# Altium project PCB_Project1.PrjPCB
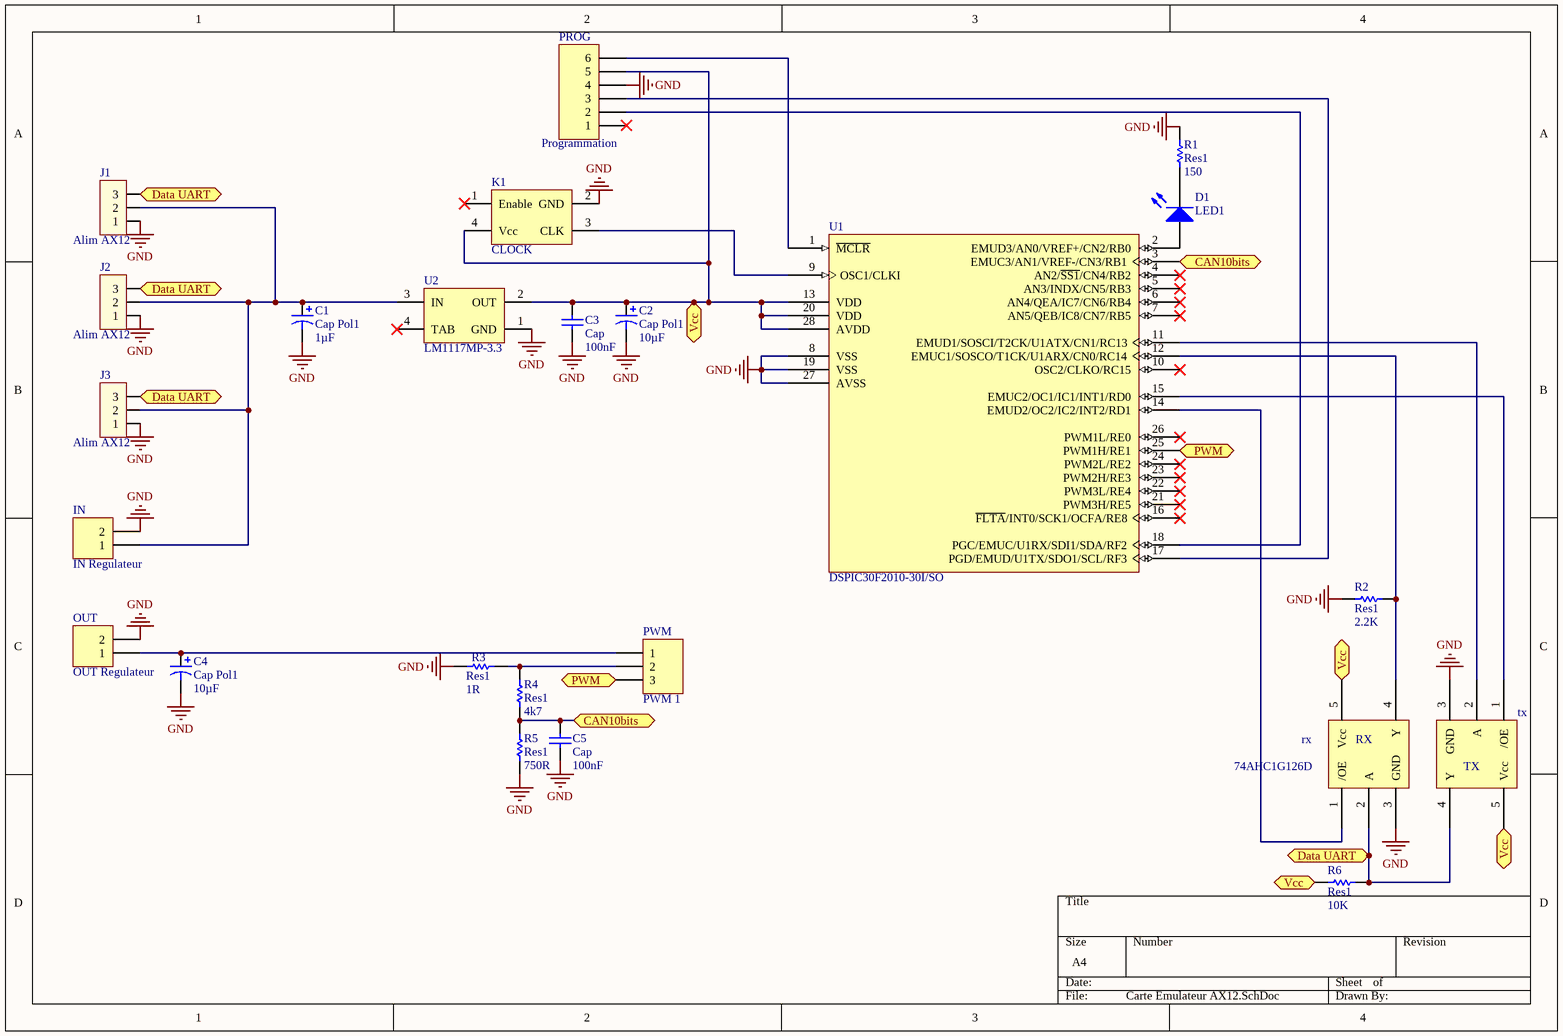
[diagram p0: Carte Emulateur AX12.SchDoc]
1 sheet, 24 parts. Net scope: flat (ports and power ports of the same name join across sheets).
Board files: Carte Emulateur AX12 - Version Double.PcbDoc, Carte Emulateur AX12.PcbDoc

## Sheet Carte Emulateur AX12.SchDoc
size A4

### Parts
C1  Cap Pol1  value 1µF  [C0805]
C2  Cap Pol1  value 10µF  [C0805]
C3  Cap  value 100nF  [0805]
C4  Cap Pol1  value 10µF  [C0805]
C5  Cap  value 100nF  [0805]
D1  LED1  [C0805]
IN  IN Regulateur  [HDR1X2]
J1  Alim AX12  [MOLEX_AX12_3]
J2  Alim AX12  [MOLEX_AX12_3]
J3  Alim AX12  [MOLEX_AX12_3]
K1  CLOCK  [IQXO-70]
OUT  OUT Regulateur  [HDR1X2]
PROG  Programmation  [690367280676]
PWM  PWM 1  [HDR1X3H]
R1  Res1  value 150  [0805]
R2  Res1  value 2.2K  [0805]
R3  Res1  value 1R  [L1W-2512]
R4  Res1  value 4k7  [0805]
R5  Res1  value 750R  [0805]
R6  Res1  value 10K  [0805]
rx  74AHC1G126D  [74AHC1G126DVBR]
tx  74AHC1G126D  [74AHC1G126DVBR]  (value not drawn)
U1  DSPIC30F2010-30I/SO  [SOIC-SO28_M]
U2  LM1117MP-3.3  [MP04A_N]

### Ports
CAN10bits, Data UART (bidir), PWM (bidir), Vcc

### Nets
GND: C1.2 C2.2 C3.1 C4.2 C5.1 IN.2 J1.1 J2.1 J3.1 K1.2(GND) OUT.2 PROG.4 R1.2 R2.2 R3.2 R5.1 rx.3(GND) tx.3(GND) U1.8(VSS) U1.19(VSS) U1.27(AVSS) U2.1(GND)
NetC1_1: C1.1 IN.1 J1.2 J2.2 J3.2 U2.3(IN)
NetC2_1: C2.1 C3.2 K1.4(Vcc) PROG.5 R6.2 rx.5(Vcc) tx.5(Vcc) U1.13(VDD) U1.20(VDD) U1.28(AVDD) U2.2(OUT) ; port Vcc
NetC4_1: C4.1 OUT.1 PWM.1
NetC5_2: C5.2 R4.1 R5.2 U1.3(EMUC3/AN1/VREF-/CN3/RB1) ; port CAN10bits
NetD1_1: D1.1(A) U1.2(EMUD3/AN0/VREF+/CN2/RB0)
NetD1_2: D1.2(K) R1.1
NetJ1_3: J1.3 J2.3 J3.3 R6.1 rx.2(A) tx.4(Y) ; port Data UART
NetK1_3: K1.3(CLK) U1.9(OSC1/CLKI)
NetPROG_2: PROG.2 U1.18(PGC/EMUC/U1RX/SDI1/SDA/RF2)
NetPROG_3: PROG.3 U1.17(PGD/EMUD/U1TX/SDO1/SCL/RF3)
NetPROG_6: PROG.6 U1.1(~{MCLR})
NetPWM_2: PWM.2 R3.1 R4.2
NetPWM_3: PWM.3 U1.25(PWM1H/RE1) ; port PWM
NetR2_1: R2.1 rx.4(Y) U1.12(EMUC1/SOSCO/T1CK/U1ARX/CN0/RC14)
Netrx_1: rx.1(/OE) U1.14(EMUD2/OC2/IC2/INT2/RD1)
Nettx_1: tx.1(/OE) U1.15(EMUC2/OC1/IC1/INT1/RD0)
Nettx_2: tx.2(A) U1.11(EMUD1/SOSCI/T2CK/U1ATX/CN1/RC13)

Not connected (* = marked no-connect by the designer): K1 1(Enable)*; PROG 1*; U1 4(AN2/~{SS1}/CN4/RB2)* 5(AN3/INDX/CN5/RB3)* 6(AN4/QEA/IC7/CN6/RB4)* 7(AN5/QEB/IC8/CN7/RB5)* 10(OSC2/CLKO/RC15)* 16(~{FLTA}/INT0/SCK1/OCFA/RE8)* 21(PWM3H/RE5)* 22(PWM3L/RE4)* 23(PWM2H/RE3)* 24(PWM2L/RE2)* 26(PWM1L/RE0)*; U2 4(TAB)*

### Notes on the sheet
- (near rx) RX
- (near tx) TX

### Library data of the parts
C1 C2 C4 = Cap Pol1: Polarized Capacitor (Radial); Published: 8-Jun-2000; LatestRevisionDate: 17-Jul-2002; LatestRevisionNote: Re-released for DXP Platform.; PackageReference: RB7.6-15; Publisher: Altium Limited
C3 C5 = Cap: Capacitor; Published: 8-Jun-2000; LatestRevisionDate: 17-Jul-2002; LatestRevisionNote: Re-released for DXP Platform.; PackageReference: RAD-0.3; Publisher: Altium Limited
D1 = LED1: Typical RED GaAs LED; Published: 8-Jun-2000; LatestRevisionDate: 08-Jul-2005; LatestRevisionNote: Mech Layer 1 removed.; PackageReference: LED-1; Publisher: Altium Limited
IN OUT = Header 2: Header, 2-Pin; LatestRevisionDate: 17-Jul-2002; LatestRevisionNote: Re-released for DXP Platform.; Publisher: Altium Limited
J1-J3 = MOLEX_AX12: Connecteur
K1 = OSCILLATEUR: Oscillateur quartz
PROG = Header 6: Header, 6-Pin; LatestRevisionDate: 17-Jul-2002; LatestRevisionNote: Re-released for DXP Platform.; Publisher: Altium Limited
PWM = Header 3: Header, 3-Pin; LatestRevisionDate: 17-Jul-2002; LatestRevisionNote: Re-released for DXP Platform.; Publisher: Altium Limited
R1-R6 = Res1: Resistor; Published: 8-Jun-2000; LatestRevisionDate: 17-Jul-2002; LatestRevisionNote: Re-released for DXP Platform.; PackageReference: AXIAL-0.3; Publisher: Altium Limited
U1 = DSPIC30F2010-30I/SO: High-Performance 16-bit Digital Signal Controller, 12 KB Flash, 512 Byte SRAM, 1 KB EEPROM, 28-Pin SOIC, Industrial Temperature; FirstPublished: 29-Jan-2009; DatasheetVersion: revH, May-2008; PackageVersion: revBB, Aug-2009; PackageReference: SOIC-SO28; Publisher: Altium Limited; PackageDescription: 28-Lead Plastic Small Outline (SO) - Wide 7.50mm Body [SOIC]; Supplier 1: Digi-Key; Supplier Part Number 1: DSPIC30F201030I/S-ND; Supplier 2: Farnell; Supplier Part Number 2: 7334199; Supplier 3: Newark; Supplier Part Number 3: 88H5549; Code_JEDEC: MS-013; ComponentLink1Description: Datasheet; ComponentLink1URL: http://ww1.microchip.com/downloads/en/DeviceDoc/70118H.pdf; ComponentLink2Description: Packaging Specification; ComponentLink2URL: http://www.microchip.com/stellent/groups/techpub_sg/documents/packagingspec/en012702.pdf; ComponentLink3Description: Microchip.com Home; ComponentLink3URL: http://www.microchip.com/
U2 = LM1117MP-3.3: 800mA Low-Dropout Linear Regulator; Manufacturer: National Semiconductor; CompType: LDO IC; PackageTopMarking: XYTT*N05A; PowerWise: N; Published: 4-Dec-2008; DatasheetVersion: Apr-2006; PackageVersion: revB, Apr-2003; PackageReference: MP04A; Publisher: Altium Limited; PackageDescription: Molded SOT-223, 6.50 x 3.56 x 1.6mm Body, 4 Lead, 2.3mm Pitch; PartNumber: LM1117MP-3.3; RoHS: O; PinCount: 4; DigiKeyPartNumber: LM1117MP-3.3CT-ND; Code_JEDEC: TO-261-AA; Code_IPC: SOT223-4; ComponentLink1Description: LM1117 Datasheet; ComponentLink1URL: http://www.national.com/ds/LM/LM1117.pdf; ComponentLink2Description: LM1117 Web Page; ComponentLink2URL: http://www.national.com/pf/LM/LM1117.html; ComponentLink3Description: MP04A Package Page; ComponentLink3URL: http://www.national.com/packaging/folders/mp04a.html